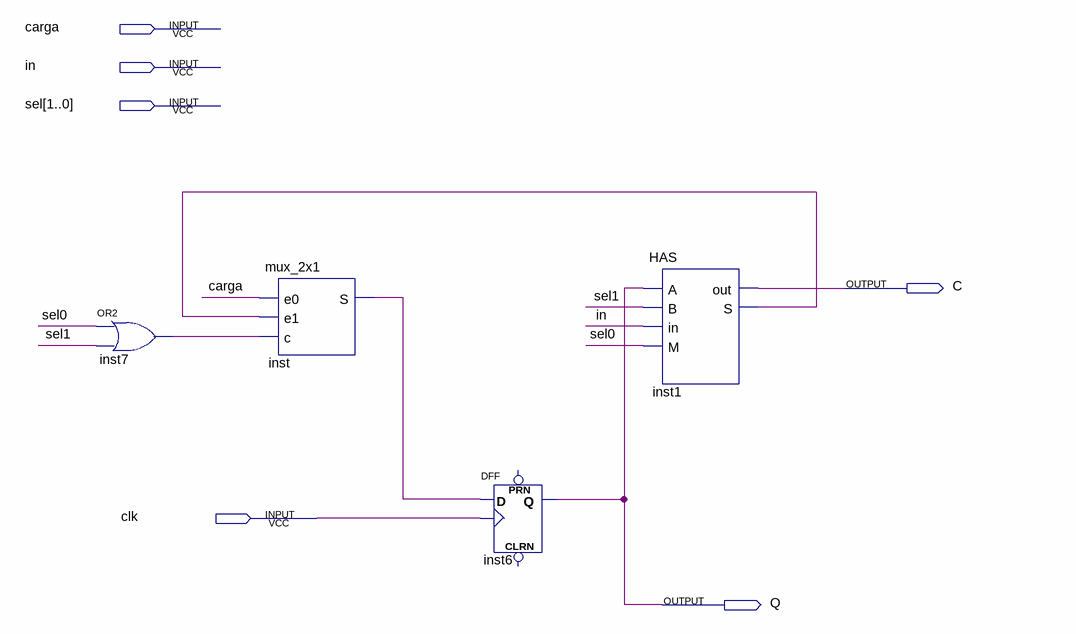
[diagram p0: schematic sheet]
// Quartus schematic cont_1bit.bdf as structural Verilog: 4 symbols, 6 pins
module cont_1bit (
  input  carga,
  input  in,
  input  [1:0] sel,
  input  clk,
  output C,
  output Q
);

  wire inst1_s, inst7_out, inst_s;

  or inst7 (inst7_out, sel[0], sel[1]);
  mux_2x1 inst (.e0(carga), .e1(inst1_s), .c(inst7_out), .S(inst_s));
  DFF inst6 (.CLK(clk), .D(inst_s), .Q(Q));  // open: CLRN, PRN
  HAS inst1 (.A(Q), .B(sel[1]), .in(in), .M(sel[0]), .out(C), .S(inst1_s));
endmodule
